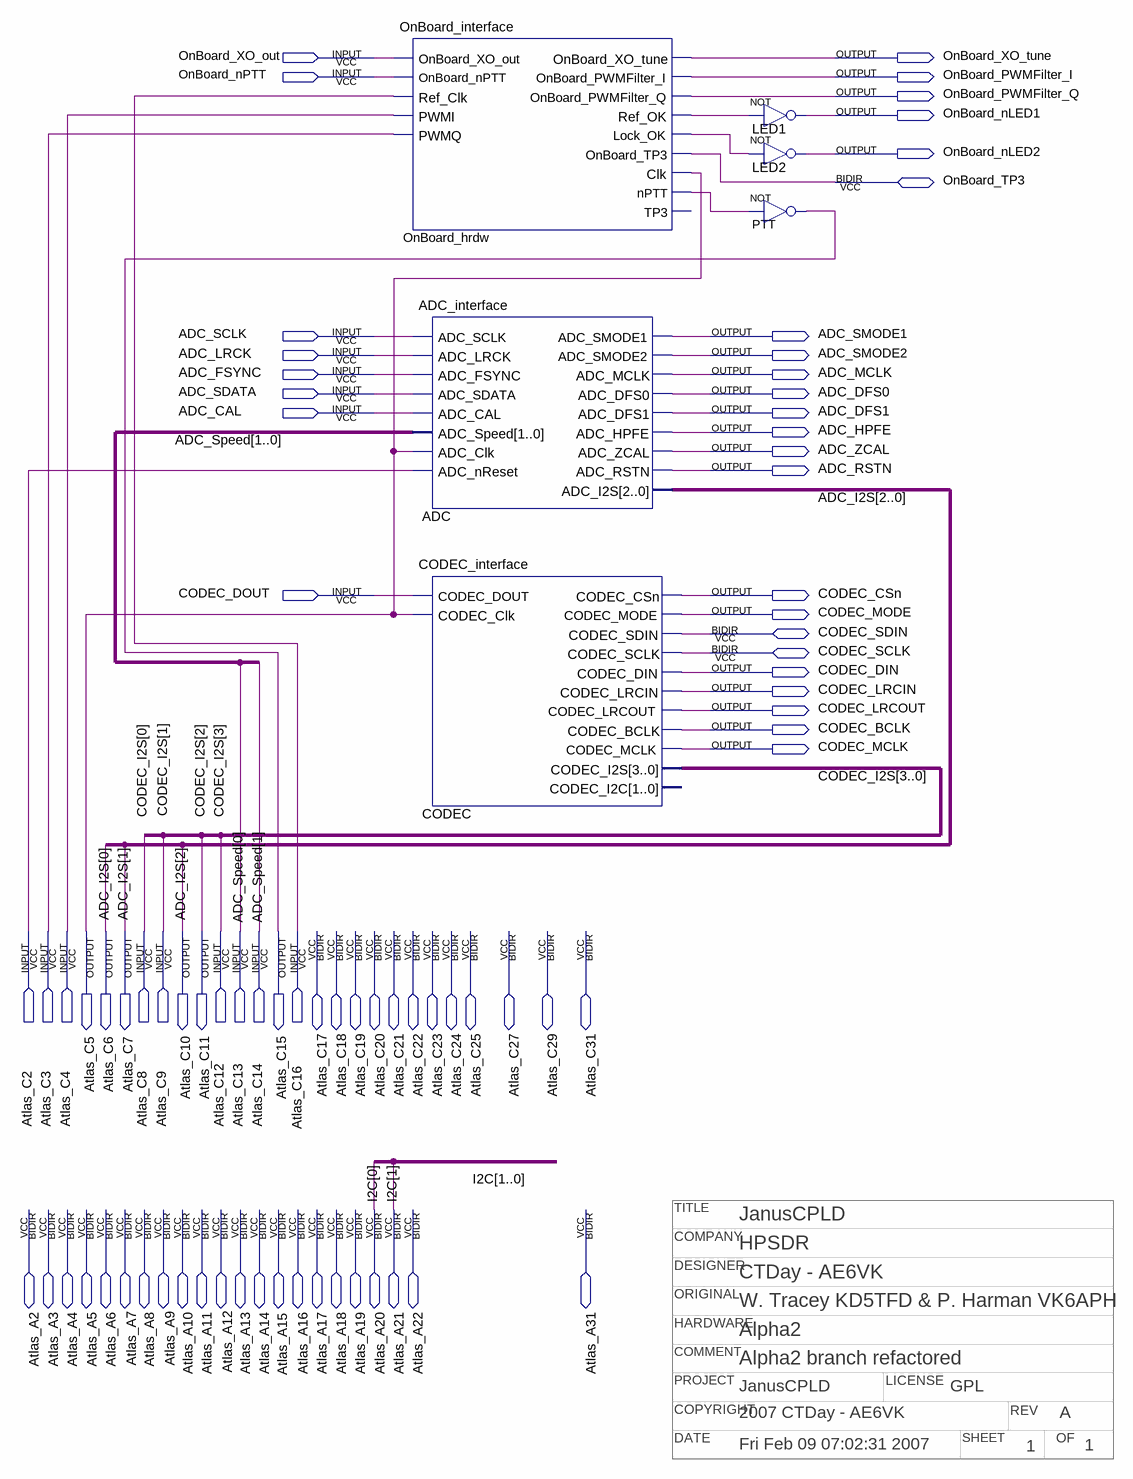
[diagram p0: schematic sheet]
// Quartus schematic JanusCPLD.bdf as structural Verilog: 6 symbols, 80 pins
// Title block: TITLE: JanusCPLD; COMPANY: HPSDR; DESIGNER: CTDay - AE6VK; COPYRIGHT: 2007 CTDay - AE6VK; REV: A; DATE: Fri Feb 09 07:02:31 2007; SHEET: 1; OF: 1; ORIGINAL: W. Tracey KD5TFD & P. Harman VK6APH; HARDWARE: Alpha2; COMMENT: Alpha2 branch refactored; PROJECT: JanusCPLD; LICENSE: GPL
module JanusCPLD (
  input  OnBoard_XO_out,
  input  OnBoard_nPTT,
  input  ADC_SCLK,
  input  ADC_LRCK,
  input  ADC_FSYNC,
  input  ADC_SDATA,
  input  ADC_CAL,
  input  CODEC_DOUT,
  input  Atlas_C2,
  input  Atlas_C3,
  input  Atlas_C4,
  input  Atlas_C8,
  input  Atlas_C9,
  input  Atlas_C12,
  input  Atlas_C13,
  input  Atlas_C14,
  input  Atlas_C16,
  inout  OnBoard_TP3,
  inout  CODEC_SDIN,
  inout  CODEC_SCLK,
  inout  Atlas_C17,
  inout  Atlas_C18,
  inout  Atlas_C19,
  inout  Atlas_C20,
  inout  Atlas_C21,
  inout  Atlas_C22,
  inout  Atlas_C23,
  inout  Atlas_C24,
  inout  Atlas_C25,
  inout  Atlas_C27,
  inout  Atlas_C29,
  inout  Atlas_C31,
  inout  Atlas_A2,
  inout  Atlas_A3,
  inout  Atlas_A4,
  inout  Atlas_A5,
  inout  Atlas_A6,
  inout  Atlas_A7,
  inout  Atlas_A8,
  inout  Atlas_A9,
  inout  Atlas_A10,
  inout  Atlas_A11,
  inout  Atlas_A12,
  inout  Atlas_A13,
  inout  Atlas_A14,
  inout  Atlas_A15,
  inout  Atlas_A16,
  inout  Atlas_A17,
  inout  Atlas_A18,
  inout  Atlas_A19,
  inout  Atlas_A20,
  inout  Atlas_A21,
  inout  Atlas_A22,
  inout  Atlas_A31,
  output OnBoard_XO_tune,
  output OnBoard_PWMFilter_I,
  output OnBoard_PWMFilter_Q,
  output OnBoard_nLED1,
  output OnBoard_nLED2,
  output ADC_SMODE1,
  output ADC_SMODE2,
  output ADC_MCLK,
  output ADC_DFS0,
  output ADC_DFS1,
  output ADC_HPFE,
  output ADC_ZCAL,
  output ADC_RSTN,
  output CODEC_CSn,
  output CODEC_MODE,
  output CODEC_DIN,
  output CODEC_LRCIN,
  output CODEC_LRCOUT,
  output CODEC_BCLK,
  output CODEC_MCLK,
  output Atlas_C5,
  output Atlas_C6,
  output Atlas_C7,
  output Atlas_C10,
  output Atlas_C11,
  output Atlas_C15
);

  wire OnBoard_hrdw_lock_ok, OnBoard_hrdw_nptt, OnBoard_hrdw_ref_ok;

  OnBoard_interface OnBoard_hrdw (
    .OnBoard_XO_out(OnBoard_XO_out), .OnBoard_nPTT(OnBoard_nPTT), .Ref_Clk(Atlas_C16), .PWMI(Atlas_C4),
    .PWMQ(Atlas_C3), .OnBoard_XO_tune(OnBoard_XO_tune), .OnBoard_PWMFilter_I(OnBoard_PWMFilter_I),
    .OnBoard_PWMFilter_Q(OnBoard_PWMFilter_Q), .Ref_OK(OnBoard_hrdw_ref_ok), .Lock_OK(OnBoard_hrdw_lock_ok),
    .Clk(Atlas_C5), .nPTT(OnBoard_hrdw_nptt), .OnBoard_TP3(OnBoard_TP3));  // open: TP3
  ADC_interface ADC (
    .ADC_SCLK(ADC_SCLK), .ADC_LRCK(ADC_LRCK), .ADC_FSYNC(ADC_FSYNC), .ADC_SDATA(ADC_SDATA),
    .ADC_CAL(ADC_CAL), .ADC_Speed({Atlas_C14, Atlas_C13}), .ADC_Clk(Atlas_C5), .ADC_nReset(Atlas_C2),
    .ADC_SMODE1(ADC_SMODE1), .ADC_SMODE2(ADC_SMODE2), .ADC_MCLK(ADC_MCLK), .ADC_DFS0(ADC_DFS0),
    .ADC_DFS1(ADC_DFS1), .ADC_HPFE(ADC_HPFE), .ADC_ZCAL(ADC_ZCAL), .ADC_RSTN(ADC_RSTN),
    .ADC_I2S({Atlas_C10, Atlas_C7, Atlas_C6}));
  CODEC_interface CODEC (
    .CODEC_DOUT(CODEC_DOUT), .CODEC_Clk(Atlas_C5), .CODEC_CSn(CODEC_CSn), .CODEC_MODE(CODEC_MODE),
    .CODEC_DIN(CODEC_DIN), .CODEC_LRCIN(CODEC_LRCIN), .CODEC_LRCOUT(CODEC_LRCOUT), .CODEC_BCLK(CODEC_BCLK),
    .CODEC_MCLK(CODEC_MCLK), .CODEC_SDIN(CODEC_SDIN), .CODEC_SCLK(CODEC_SCLK),
    .CODEC_I2S({Atlas_C12, Atlas_C11, Atlas_C9, Atlas_C8}));  // open: CODEC_I2C
  not LED1 (OnBoard_nLED1, OnBoard_hrdw_ref_ok);
  not LED2 (OnBoard_nLED2, OnBoard_hrdw_lock_ok);
  not PTT (Atlas_C15, OnBoard_hrdw_nptt);

  // Other names for the same wires on the sheet: ADC_I2S[2:0] = {Atlas_C10, Atlas_C7, Atlas_C6};
  //   ADC_Speed[1:0] = {Atlas_C14, Atlas_C13}; CODEC_I2S[3:0] = {Atlas_C12, Atlas_C11, Atlas_C9, Atlas_C8};
  //   I2C[1:0] = {Atlas_A21, Atlas_A20}
endmodule
